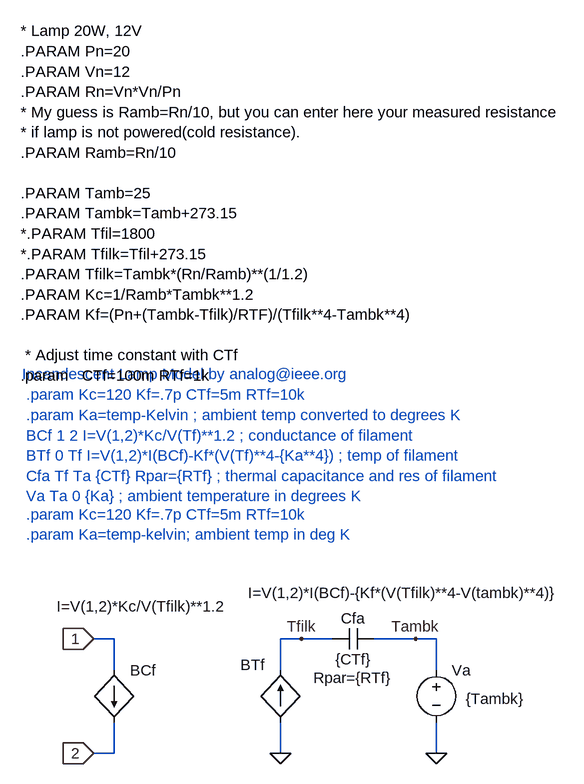
[diagram p0: schematic lamp1.asc]
lamp1.asc, the LTspice schematic file:
Version 4
SHEET 1 1224 680
WIRE 0 432 0 384
WIRE 0 304 0 256
WIRE 240 384 240 432
WIRE -256 256 -256 304
WIRE -256 384 -256 432
WIRE -256 432 -288 432
WIRE -288 256 -256 256
WIRE 240 256 240 304
WIRE 80 256 32 256
WIRE 240 256 208 256
WIRE 32 256 0 256
WIRE 208 256 144 256
FLAG 0 432 0
FLAG 240 432 0
FLAG 32 256 Tfilk
FLAG 208 256 Tambk
FLAG -288 256 1
IOPIN -288 256 In
FLAG -288 432 2
IOPIN -288 432 In
SYMBOL bi 0 384 R180
WINDOW 0 24 88 Left 0
WINDOW 3 50 199 Right 0
SYMATTR InstName BTf
SYMATTR Value I=V(1,2)*I(BCf)-{Kf*(V(Tfilk)**4-V(tambk)**4)}
SYMBOL cap 80 272 R270
WINDOW 0 32 32 VTop 0
WINDOW 3 0 32 VBottom 0
WINDOW 39 -28 32 VBottom 0
SYMATTR InstName Cfa
SYMATTR Value {CTf}
SYMATTR SpiceLine Rpar={RTf}
SYMBOL voltage 240 288 R0
WINDOW 3 45 60 Left 0
SYMATTR Value {Tambk}
SYMATTR InstName Va
SYMBOL bi -256 304 R0
WINDOW 3 41 -98 Center 0
SYMATTR Value I=V(1,2)*Kc/V(Tfilk)**1.2
SYMATTR InstName BCf
TEXT -392 64 Left 0 ;.param Kc=120 Kf=.7p CTf=5m RTf=10k\n.param Ka=temp-kelvin; ambient temp in deg K
TEXT -392 -120 Left 0 ;.param Kc=120 Kf=.7p CTf=5m RTf=10k\n.param Ka=temp-Kelvin ; ambient temp converted to degrees K\nBCf 1 2 I=V(1,2)*Kc/V(Tf)**1.2 ; conductance of filament\nBTf 0 Tf I=V(1,2)*I(BCf)-Kf*(V(Tf)**4-{Ka**4}) ; temp of filament\nCfa Tf Ta {CTf} Rpar={RTf} ; thermal capacitance and res of filament\nVa Ta 0 {Ka} ; ambient temperature in degrees K
TEXT -144 -152 Center 0 ;Incandescent Lamp Model by analog@ieee.org
TEXT -400 -680 Left 0 !* Lamp 20W, 12V\n.PARAM Pn=20\n.PARAM Vn=12\n.PARAM Rn=Vn*Vn/Pn\n* My guess is Ramb=Rn/10, but you can enter here your measured resistance\n* if lamp is not powered(cold resistance).\n.PARAM Ramb=Rn/10\n \n.PARAM Tamb=25\n.PARAM Tambk=Tamb+273.15\n*.PARAM Tfil=1800\n*.PARAM Tfilk=Tfil+273.15\n.PARAM Tfilk=Tambk*(Rn/Ramb)**(1/1.2)\n.PARAM Kc=1/Ramb*Tambk**1.2\n.PARAM Kf=(Pn+(Tambk-Tfilk)/RTF)/(Tfilk**4-Tambk**4)\n \n * Adjust time constant with CTf\n.param   CTf=100m RTf=1k

The netlist it stands for:
* lamp1.asc
BTf 0 Tfilk I=V(1,2)*I(BCf)-{Kf*(V(Tfilk)**4-V(tambk)**4)}
Cfa Tfilk Tambk {CTf} Rpar={RTf}
Va Tambk 0 {Tambk}
BCf 1 2 I=V(1,2)*Kc/V(Tfilk)**1.2
* .param Kc=120 Kf=.7p CTf=5m RTf=10k
* .param Ka=temp-kelvin; ambient temp in deg K
* .param Kc=120 Kf=.7p CTf=5m RTf=10k
* .param Ka=temp-Kelvin ; ambient temp converted to degrees K
* BCf 1 2 I=V(1,2)*Kc/V(Tf)**1.2 ; conductance of filament
* BTf 0 Tf I=V(1,2)*I(BCf)-Kf*(V(Tf)**4-{Ka**4}) ; temp of filament
* Cfa Tf Ta {CTf} Rpar={RTf} ; thermal capacitance and res of filament
* Va Ta 0 {Ka} ; ambient temperature in degrees K
* Incandescent Lamp Model by analog@ieee.org
* Lamp 20W, 12V
.PARAM Pn=20
.PARAM Vn=12
.PARAM Rn=Vn*Vn/Pn
* My guess is Ramb=Rn/10, but you can enter here your measured resistance
* if lamp is not powered(cold resistance).
.PARAM Ramb=Rn/10
.PARAM Tamb=25
.PARAM Tambk=Tamb+273.15
*.PARAM Tfil=1800
*.PARAM Tfilk=Tfil+273.15
.PARAM Tfilk=Tambk*(Rn/Ramb)**(1/1.2)
.PARAM Kc=1/Ramb*Tambk**1.2
.PARAM Kf=(Pn+(Tambk-Tfilk)/RTF)/(Tfilk**4-Tambk**4)
 * Adjust time constant with CTf
.param   CTf=100m RTf=1k
.backanno
.end